# Altium schematic sheet SchemaB.SchDoc
size A3; Organization: ETML-ES; Address1: Avenue Recordon 1; Address2: 1004 Lausanne; Address3: Switzerland; SheetNumber: 2; SheetTotal: 3
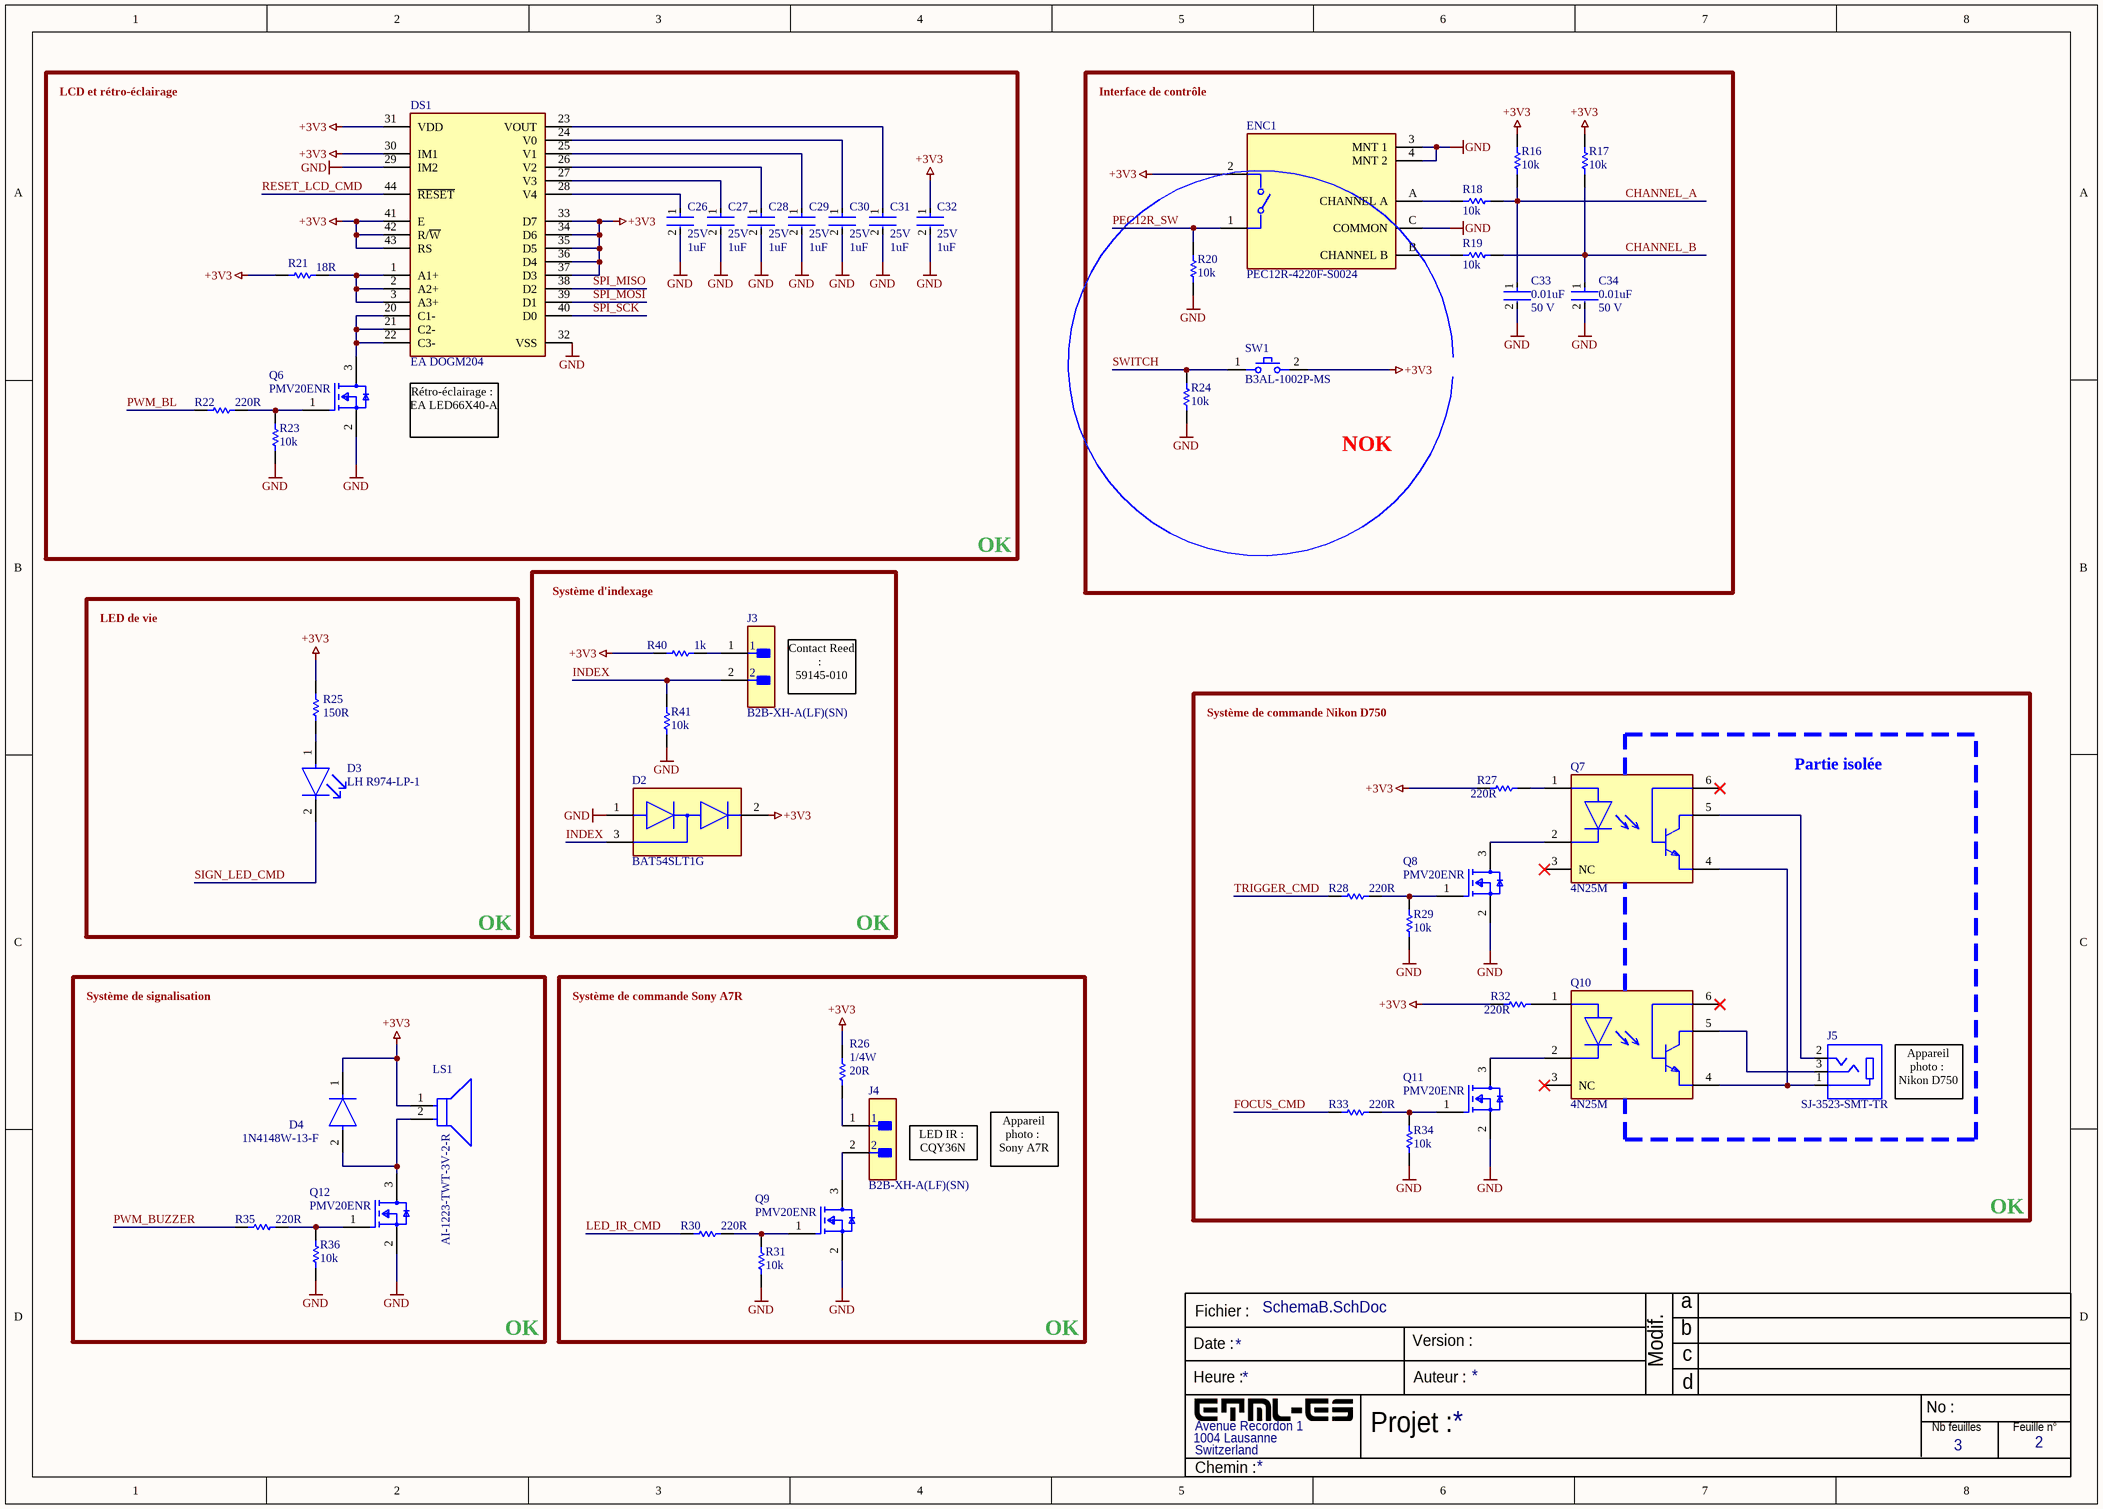
[diagram p0: SchemaB.SchDoc]

## Parts
C26  Voltage Rating: 25V  Capacitance: 1uF  [FP-CL21-IPC_B]  (hidden comment: CL21F105ZAFNNNF)
C27  Voltage Rating: 25V  Capacitance: 1uF  [FP-CL21-IPC_B]  (hidden comment: CL21F105ZAFNNNF)
C28  Voltage Rating: 25V  Capacitance: 1uF  [FP-CL21-IPC_B]  (hidden comment: CL21F105ZAFNNNF)
C29  Voltage Rating: 25V  Capacitance: 1uF  [FP-CL21-IPC_B]  (hidden comment: CL21F105ZAFNNNF)
C30  Voltage Rating: 25V  Capacitance: 1uF  [FP-CL21-IPC_B]  (hidden comment: CL21F105ZAFNNNF)
C31  Voltage Rating: 25V  Capacitance: 1uF  [FP-CL21-IPC_B]  (hidden comment: CL21F105ZAFNNNF)
C32  Voltage Rating: 25V  Capacitance: 1uF  [FP-CL21-IPC_B]  (hidden comment: CL21F105ZAFNNNF)
C33  value 0.01uF  Voltage Rating: 50 V  [FP-C0805C-DN-MFG]  (hidden comment: C0805C103J5RAC7210)
C34  value 0.01uF  Voltage Rating: 50 V  [FP-C0805C-DN-MFG]  (hidden comment: C0805C103J5RAC7210)
D2  BAT54SLT1G  [FP-318-08-IPC_B]
D3  LH R974-LP-1  [FP-LH_R974-MFG]
D4  1N4148W-13-F  [FP-SOD123-MFG]
DS1  EA DOGM204  [EA DOGM204]
ENC1  PEC12R-4220F-S0024  [FP-PEC12R-4220F-S0024-MFG]
J3  B2B-XH-A(LF)(SN)  [FP-B2B-XH-A_LF_SN-MFG]
J4  B2B-XH-A(LF)(SN)  [FP-B2B-XH-A_LF_SN-MFG]
J5  SJ-3523-SMT-TR  [CUI_SJ-3523-SMT]
LS1  AI-1223-TWT-3V-2-R  [FP-AI-1223-TWT-3V-2-R-MFG]
Q6  PMV20ENR  [FP-SOT23-MFG]
Q7  4N25M  [FP-646BX-MFG]
Q8  PMV20ENR  [FP-SOT23-MFG]
Q9  PMV20ENR  [FP-SOT23-MFG]
Q10  4N25M  [FP-646BX-MFG]
Q11  PMV20ENR  [FP-SOT23-MFG]
Q12  PMV20ENR  [FP-SOT23-MFG]
R16  Resistance: 10k  [RESC2013X60X35ML10T20]  (hidden comment: RC0805JR-0710KL)
R17  Resistance: 10k  [RESC2013X60X35ML10T20]  (hidden comment: RC0805JR-0710KL)
R18  Resistance: 10k  [RESC2013X60X35ML10T20]  (hidden comment: RC0805JR-0710KL)
R19  Resistance: 10k  [RESC2013X60X35ML10T20]  (hidden comment: RC0805JR-0710KL)
R20  Resistance: 10k  [RESC2013X60X35ML10T20]  (hidden comment: RC0805JR-0710KL)
R21  value 18R  [RESC2013X70X40ML20T20]  (hidden comment: ERJ6ENF18R0V)
R22  value 220R  [RESC2013X70X40NL20T20]  (hidden comment: ERJ6ENF2200V)
R23  Resistance: 10k  [RESC2013X60X35ML10T20]  (hidden comment: RC0805JR-0710KL)
R24  Resistance: 10k  [RESC2013X60X35ML10T20]  (hidden comment: RC0805JR-0710KL)
R25  value 150R  [RESC2013X60X35ML10T20]  (hidden comment: RC0805JR-0775RL)
R26  value 20R  Puissance: 1/4W  [RESC2013X60X30ML20T20]  (hidden comment: RK73B2ATTD200J)
R27  value 220R  [RESC2013X50X30NL20T20]  (hidden comment: CRCW0805210RFKEA)
R28  value 220R  [RESC2013X70X40NL20T20]  (hidden comment: ERJ6ENF2200V)
R29  Resistance: 10k  [RESC2013X60X35ML10T20]  (hidden comment: RC0805JR-0710KL)
R30  value 220R  [RESC2013X70X40NL20T20]  (hidden comment: ERJ6ENF2200V)
R31  Resistance: 10k  [RESC2013X60X35ML10T20]  (hidden comment: RC0805JR-0710KL)
R32  value 220R  [RESC2013X50X30NL20T20]  (hidden comment: CRCW0805210RFKEA)
R33  value 220R  [RESC2013X70X40NL20T20]  (hidden comment: ERJ6ENF2200V)
R34  Resistance: 10k  [RESC2013X60X35ML10T20]  (hidden comment: RC0805JR-0710KL)
R35  value 220R  [RESC2013X70X40NL20T20]  (hidden comment: ERJ6ENF2200V)
R36  Resistance: 10k  [RESC2013X60X35ML10T20]  (hidden comment: RC0805JR-0710KL)
R40  Resistance: 1k  [RESC2013X60X35ML10T20]  (hidden comment: RC0805FR-071KL)
R41  Resistance: 10k  [RESC2013X60X35ML10T20]  (hidden comment: RC0805JR-0710KL)
SW1  B3AL-1002P-MS  [FP-B3AL-1002P-MS-MFG]

## Blocks framed on the sheet
OK: C26-C32 DS1 Q6 R21-R23
NOK: C33 C34 ENC1 R16-R20 R24 SW1
OK: D3 R25
OK: D2 J3 R40 R41
OK: J5 Q7 Q8 Q10 Q11 R27-R29 R32-R34
OK: D4 LS1 Q12 R35 R36
OK: J4 Q9 R26 R30 R31

## Nets
+3V3: C32.1 D2.2(C) D4.1(C) DS1.30(IM1) DS1.31(VDD) DS1.33(D7) DS1.34(D6) DS1.35(D5) DS1.36(D4) DS1.37(D3) DS1.41(E) DS1.42(R/~{W}) DS1.43(RS) ENC1.2 LS1.1(C) R16.1 R17.1 R21.1 R25.2 R26.2 R27.1 R32.1 R40.1 SW1.2
GND: C26.2 C27.2 C28.2 C29.2 C30.2 C31.2 C32.2 C33.2 C34.2 D2.1(A) DS1.29(IM2) DS1.32(VSS) ENC1.3(MNT_1) ENC1.4(MNT_2) ENC1.C(COMMON) Q6.2(S) Q8.2(S) Q9.2(S) Q11.2(S) Q12.2(S) R20.2 R23.1 R24.2 R29.1 R31.1 R34.1 R36.1 R41.2
CHANNEL_A: C33.1 R16.2 R18.1
CHANNEL_B: C34.1 R17.2 R19.1
FOCUS_CMD: R33.1
INDEX: D2.3(CATHODE/ANODE) J3.2 R41.1
LED_IR_CMD: R30.1
PEC12R_SW: ENC1.1 R20.1
PWM_BL: R22.1
PWM_BUZZER: R35.1
RESET_LCD_CMD: DS1.44(~{RESET})
SIGN_LED_CMD: D3.2(C)
SPI_MISO: DS1.38(D2)
SPI_MOSI: DS1.39(D1)
SPI_SCK: DS1.40(D0)
SWITCH: R24.1 SW1.1
TRIGGER_CMD: R28.1
NetC26_1: C26.1 DS1.28(V4)
NetC27_1: C27.1 DS1.27(V3)
NetC28_1: C28.1 DS1.26(V2)
NetC29_1: C29.1 DS1.25(V1)
NetC30_1: C30.1 DS1.24(V0)
NetC31_1: C31.1 DS1.23(VOUT)
NetD3_1: D3.1(A) R25.1
NetD4_2: D4.2(A) LS1.2(A) Q12.3(D)
NetDS1_1: DS1.1(A1+) DS1.2(A2+) DS1.3(A3+) R21.2
NetDS1_20: DS1.20(C1-) DS1.21(C2-) DS1.22(C3-) Q6.3(D)
NetENC1_A: ENC1.A(CHANNEL_A) R18.2
NetENC1_B: ENC1.B(CHANNEL_B) R19.2
NetJ3_1: J3.1 R40.2
NetJ4_1: J4.1 R26.1
NetJ4_2: J4.2 Q9.3(D)
NetJ5_1: J5.1 Q7.4(E) Q10.4(E)
NetJ5_2: J5.2 Q7.5(C)
NetJ5_3: J5.3 Q10.5(C)
NetQ6_1: Q6.1(G) R22.2 R23.2
NetQ7_1: Q7.1(A) R27.2
NetQ7_2: Q7.2(C) Q8.3(D)
NetQ8_1: Q8.1(G) R28.2 R29.2
NetQ9_1: Q9.1(G) R30.2 R31.2
NetQ10_1: Q10.1(A) R32.2
NetQ10_2: Q10.2(C) Q11.3(D)
NetQ11_1: Q11.1(G) R33.2 R34.2
NetQ12_1: Q12.1(G) R35.2 R36.2

Not connected (* = marked no-connect by the designer): Q7 3(NC)* 6(B)*; Q10 3(NC)* 6(B)*

## Notes on the sheet
- LCD et rétro-éclairage
- (near ENC1) Interface de contrôle
- Rétro-éclairage :
  EA LED66X40-A
- LED de vie
- Système d'indexage
- (near J3) Contact Reed :
  59145-010
- Système de commande Nikon D750
- Partie isolée
- Système de signalisation
- Système de commande Sony A7R
- Appareil photo :
  Nikon D750
- (near J4) LED IR :
  CQY36N
- Appareil photo :
  Sony A7R
- Fichier :
- a
- Date :
- Heure :
- Version :
- Auteur :
- Modif.
- b
- c
- d
- Projet :
- No :
- Nb feuilles
- Feuille n°
- Chemin :

## Library data of the parts
C26-C32 = CMP-13271-002018-1: CL21 Series 0805 1uF 25V -20/+80% Tolerance Y5V Multilayer Ceramic Chip Capacitor; Tolerance: 80%; Voltage Rating (DC): 25V; Thickness: 0.053inch; Radiation Hardening: No; Width: 0.049inch; Height: 1.25mm; Max Operating Temperature: 85°C; Mount: Surface Mount; Package Quantity: 10000; Depth: 1.25mm; Min Operating Temperature: -30°C; Packaging: Tape and Reel; Case/Package: 0805; Length: 2mm; Dielectric: Y5V
C33 C34 = CMP-2007-01173-3: CAP CER SMD 0805 .01UF X7R 5% 50; Manufacturer: KEMET; Temperature Coefficient: 30ppm/°C; Tolerance: 0.05; Capacitance: 10,000 pF; Material: Ceramic; Digikey Description: CAP CER SMD 0805 .01UF X7R 5% 50; Temperature Characteristic: X7R; Manufacturer Part Number: C0805C103J5RAC7210; ComponentLink2URL: https://content.kemet.com/datasheets/KEM_C1003_C0G_SMD.pdf; ComponentLink2Description: Datasheet; Temperature Range High: +125°C; Package: C0805C-DN; Category: Cap; RoHS: TRUE; Device Class L1: Passive Components; Ipc Land Pattern Name: CAPC200125X78; Mouser Description: Cap Ceramic 0.01uF 50V X7R 5% Pad SMD 0805 125C T/R; Temperature: -55°C to +125°C; Octopart: https://octopart.com/c0805c103j5rac7210-kemet-3921106; Height: 0.88mm; Temperature Range Low: -55°C; Device Class L3: Ceramic Capacitors; Device Class L2: Capacitors; Lead Free: Yes; Automotive: No
D2 = CMP-1055-00536-2: DIODE ARRAY SCHOTTKY 30V SOT23-3; Peak Reverse Current: 2uA; Element Configuration: Dual; Max Forward Surge Current (Ifsm): 600mA; Forward Voltage: 800mV; Recovery Time: 5ns; Peak Non-Repetitive Surge Current: 1A; Capacitance: 10pF; Power Dissipation: 225mW; Average Rectified Current: 200mA; Height: 0.94mm; Radiation Hardening: No; Width: 1.3mm; Number of Pins: 3; Max Repetitive Reverse Voltage (Vrrm): 30V; Package Quantity: 3000; Contact Plating: Tin; Case/Package: SOT-23-3; Length: 2.9mm; Max Reverse Voltage (DC): 30V; Reverse Recovery Time: 5ns; Lead Free: Lead Free; REACH SVHC: No SVHC; Max Operating Temperature: 150°C; Max Reverse Leakage Current: 2uA; Voltage Rating (DC): 30V; Max Surge Current: 600mA; Forward Current: 200mA; Packaging: Tape and Reel; Halogen Free: Halogen Free; Min Operating Temperature: -55°C; Current Rating: 200mA
D3 = CMP-2000-06540-2: LED RED DIFFUSED 0805 SMD; Number of Elements: 1; Forward Voltage: 2.6V; Viewing Angle: 160°; Reverse Voltage: 5V; Test Current: 20mA; Dominant Wavelength: 645nm; Forward Current: 30mA; Luminous Intensity: 15mcd; Depth: 1.35mm; Min Operating Temperature: -30°C; Length: 2.1mm; Max Operating Temperature: 85°C; Radiation Hardening: No; Packaging: Tape and Reel; Number of Pins: 2; Mount: Surface Mount; Lens Style: Diffused
D4 = CMP-12791-000005-1: DIODE GEN PURP 100V 150MA SOD123; Manufacturer: Diodes Inc.; Capacitance: 2pF; Forward Current: 300mA; Max Junction Temp: +150°C; Value: 2pF; Standoff Height: 0mm; Peak Reverse Current: 1uA; Max Surge Forward Current: 1A; Category: Diode; Height: 1.45mm; ComponentLink2URL: https://upverter.com/datasheet/628e7d6fee5901eee6eef4567d1c3569f2cd3cde.pdf; Lead Free: Yes; ComponentLink2Description: Datasheet; Octopart: https://octopart.com/1n4148w-13-f-diodes+inc.-2359612; Temperature Range High: +150°C; Device Class L2: Diodes; Digikey Description: DIODE GEN PURP 100V 150MA SOD123; Reverse Voltage: 100V; Temperature Range Low: -65°C; Device Class L1: Discrete Semiconductors; Package: SOD123; RoHS: TRUE; Manufacturer Part Number: 1N4148W-13-F; Footprint Url: https://www.diodes.com/assets/Package-Files/SOD123.pdf; Automotive: No; Max Repetitive Reverse Voltage: 100V; Mouser Description: 1N4148W Series 2 A 100 V 400 mW Surface Mount Fast Switching Diode - SOD-123; Temperature: -65°C to +150°C; Device Class L3: Rectifier Diodes
ENC1 = CMP-07421-000021-1: ROTARY ENCODER MECHANICAL 24PPR; Built in Switch: Yes; Pulses per Revolution: 24; Output Type: Quadrature; Hole Diameter: 2mm; Number of Channels: 2; Max Supply Voltage (DC): 5V; RoHS Compliant: Yes; Max Operating Temperature: 70°C; Length: 26mm; Width: 12.5mm; Encoder Type: Mechanical; Series: PEC12R; Mount: Through Hole; Height: 13.4mm; Packaging: Bulk; Package Quantity: 150; Termination: PC Pin; Min Operating Temperature: -30°C; REACH SVHC: No SVHC; Detent: Yes; Orientation: Vertical
J3 J4 = CMP-2000-05888-3: CONN HEADER VERT 2POS 2.5MM; Current Rating: 3A; Voltage Rating: 250V; Number of Contacts: 2; Contact Resistance: 20mR; Wire/Cable Gauge: 22AWG; Insulation Resistance: 1GR; Connector Type: Male Pin; Packaging: Bulk; Contact Material: Brass; Lead Free: Lead Free; Orientation: Straight; Contact Plating: Tin; Max Current Rating: 3A; Termination: Solder; Fastening Type: Detent; Depth: 5.75mm; Housing Material: Polyamide; REACH SVHC: No SVHC; Series: XH; Voltage Rating (AC): 250V; Number of Positions: 2; Color: Natural; Contact Type: Male Pin; Max Voltage Rating (DC): 250V; Pitch: 2.5mm; Lead Pitch: 2.5mm; Mount: Through Hole; Max Operating Temperature: 85°C; Length: 7.4mm; Max Voltage Rating (AC): 250V; Min Operating Temperature: -25°C; Number of Rows: 1; Housing Color: White
J5 = SJ-3523-SMT
LS1 = CMP-103888-000003-1: BUZZER MAGNETIC 3V 12MM TH; Min Supply Voltage (DC): 2V; Operating Supply Current: 30mA; Max Supply Voltage (DC): 4V; Input Type: DC; Frequency: 2.3kHz; Series: AI; Nominal Supply Voltage (DC): 3V; Packaging: Tray; Max Operating Temperature: 70°C; Height: 7.5mm; Termination: PC Pins; Max Supply Current: 30mA; Mount: Through Hole; Diameter: 12mm; Voltage Rating: 3V; Sensing Method: Magnetic; Min Operating Temperature: -20°C; Contact Plating: Tin
Q6 Q8 Q9 Q11 Q12 = CMP-14409-000013-1: MOSFET N-CH 30V SOT23
Q7 Q10 = CMP-00278-84323282-1: 4N25M Optocoupler DC-IN 1-CH Transistor With Base DC-OUT 6-Pin PDIP Tube - Bulk; Manufacturer Lifecycle Status: ACTIVE; Isolation Voltage: 7.5kV; Number of Circuits: 1; Collector Emitter Voltage (VCEO): 500mV; Max Junction Temperature (Tj): 125°C; Collector Emitter Breakdown Voltage: 30V; Forward Current: 10mA; Max Input Current: 50mA; Turn-Off Delay Time: 2µs; Current Transfer Ratio: 20%; Reverse Voltage: 6V; Power Dissipation: 250mW; Max Power Dissipation: 200mW; Approvals: UL; Forward Voltage: 1.18V; Max Operating Temperature: 100°C; Min Operating Temperature: -55°C; RoHS: Compliant; Lifecycle Status: Production; NexarPartId: 84323282; Weight: 855mg; Reverse Breakdown Voltage: 6V; Rise Time: 2µs; Case/Package: DIP; Max Output Voltage: 30V; Number of Elements: 1; Output Voltage: 30V; Mount: Through Hole; REACH SVHC: No SVHC; Length: 7.12mm; Input Current: 10mA; Collector Emitter Saturation Voltage: 500mV; Width: 6.5mm; Schedule B: 8541408000, 8541408000; Height: 5.08mm; Turn-On Delay Time: 2µs; Number of Pins: 6; Fall Time: 2µs; Radiation Hardening: No; Lead Free: Lead Free; Number of Channels: 1
R16-R20 R23 R24 R29 R31 R34 R36 R41 = CMP-2000-05025-1: Chip Resistor, 10 KOhm, +/- 5%, 0.125 W, -55 to 155 degC, 0805 (2012 Metric), RoHS, Tape and Reel; Manufacturer: Yageo; Resistor Element Type: ThickFilm; Voltage Rating: 150V; Product Range: RCSeries; SVHC: ToBeAdvised; Resistor Case Style: 0805[2012Metric]; Temperature Coefficient: ±100ppm/degC; Power Rating: 250mW; Automotive Qualification Standard: -; Datasheet Version: REV. 2, 09/2004; Packaging: CutTape; Resistance Tolerance: ±5%; MSL: MSL1-Unlimited; Manufacturer URL: http://www.yageo.com/; Datasheet URL: http://www.yageo.ru/pdf/RC0805.pdf; Package Description: 2-Pin Surface Mounted Device, Body 2 x 1.25 mm; Package Reference: 805
R21 = CMP-2001-00520-1: Manufacturer: Panasonic; Part Number: ERJ6ENF18R0V
R22 R28 R30 R33 R35 = CMP-2001-00044-1: Manufacturer: Panasonic; Part Number: ERJ6ENF2200V
R25 = CMP-2001-01402-1: Manufacturer: Yageo; Part Number: RC0805JR-0775RL
R26 = CMP-2001-01797-1: Manufacturer: KOA Speer; Part Number: RK73B2ATTD200J
R27 R32 = CMP-1013-00431-2: Manufacturer: Vishay Dale; Part Number: CRCW0805210RFKEA
R40 = CMP-2100-03671-1: Chip Resistor, 1 KOhm, +/- 1%, 125 mW, -55 to 155 degC, 0805 (2012 Metric), RoHS, Tape and Reel; Manufacturer: Yageo; Temperature Coefficient: 100ppm/degreesC; Voltage Rating (DC): 150V; Max Power Dissipation: 125mW; Number of Pins: 2; Number of Terminations: 2; Datasheet URL: http://www.yageo.com/NewPortal/yageodocoutput?fileName=/pdf/R-Chip/PYu-RC_Group_51_RoHS_L_5.pdf; Length: 0.079inch; Package Description: 2-Pin Surface Mounted Device, Body 2 x 1.25 mm; Depth: 1.25mm; Height: 0.024inch; Military Standard: Not; Case/Package: 0805; Package Reference: 0805; RoHSCompliant: true; Lead Free: LeadFree; Packaging: TapeandReel; Package Quantity: 1; Datasheet Version: Rev. 5, 10/2016; Tolerance: 1%; Min Operating Temperature: -55degC; Voltage Rating: 150V; Composition: ThickFilm; Case Code (Imperial): 0805; Power Rating: 125mW; Width: 0.049inch; Case Code (Metric): 2012; Manufacturer URL: http://www.yageo.com/; Max Operating Temperature: 155degC; REACH SVHC: Unknown; Termination: SMD/SMT
SW1 = CMP-08834-000021-1: SWITCH TACTILE SPST-NO 0.05A 16V; Throw Configuration: SPST; Illumination Type: Non-Illuminated; Mechanical Life: 1000000Cycles; Operating Force: 306gf; Switch Travel: 1.3mm; Switch Function: Off-Mom; Mount: Surface Mount; Packaging: Cut Tape; Min Operating Temperature: -40°C; Termination: SMD/SMT; Max Operating Temperature: 90°C